# Altium schematic sheet 17.SchDoc
size 513 x 386 mm
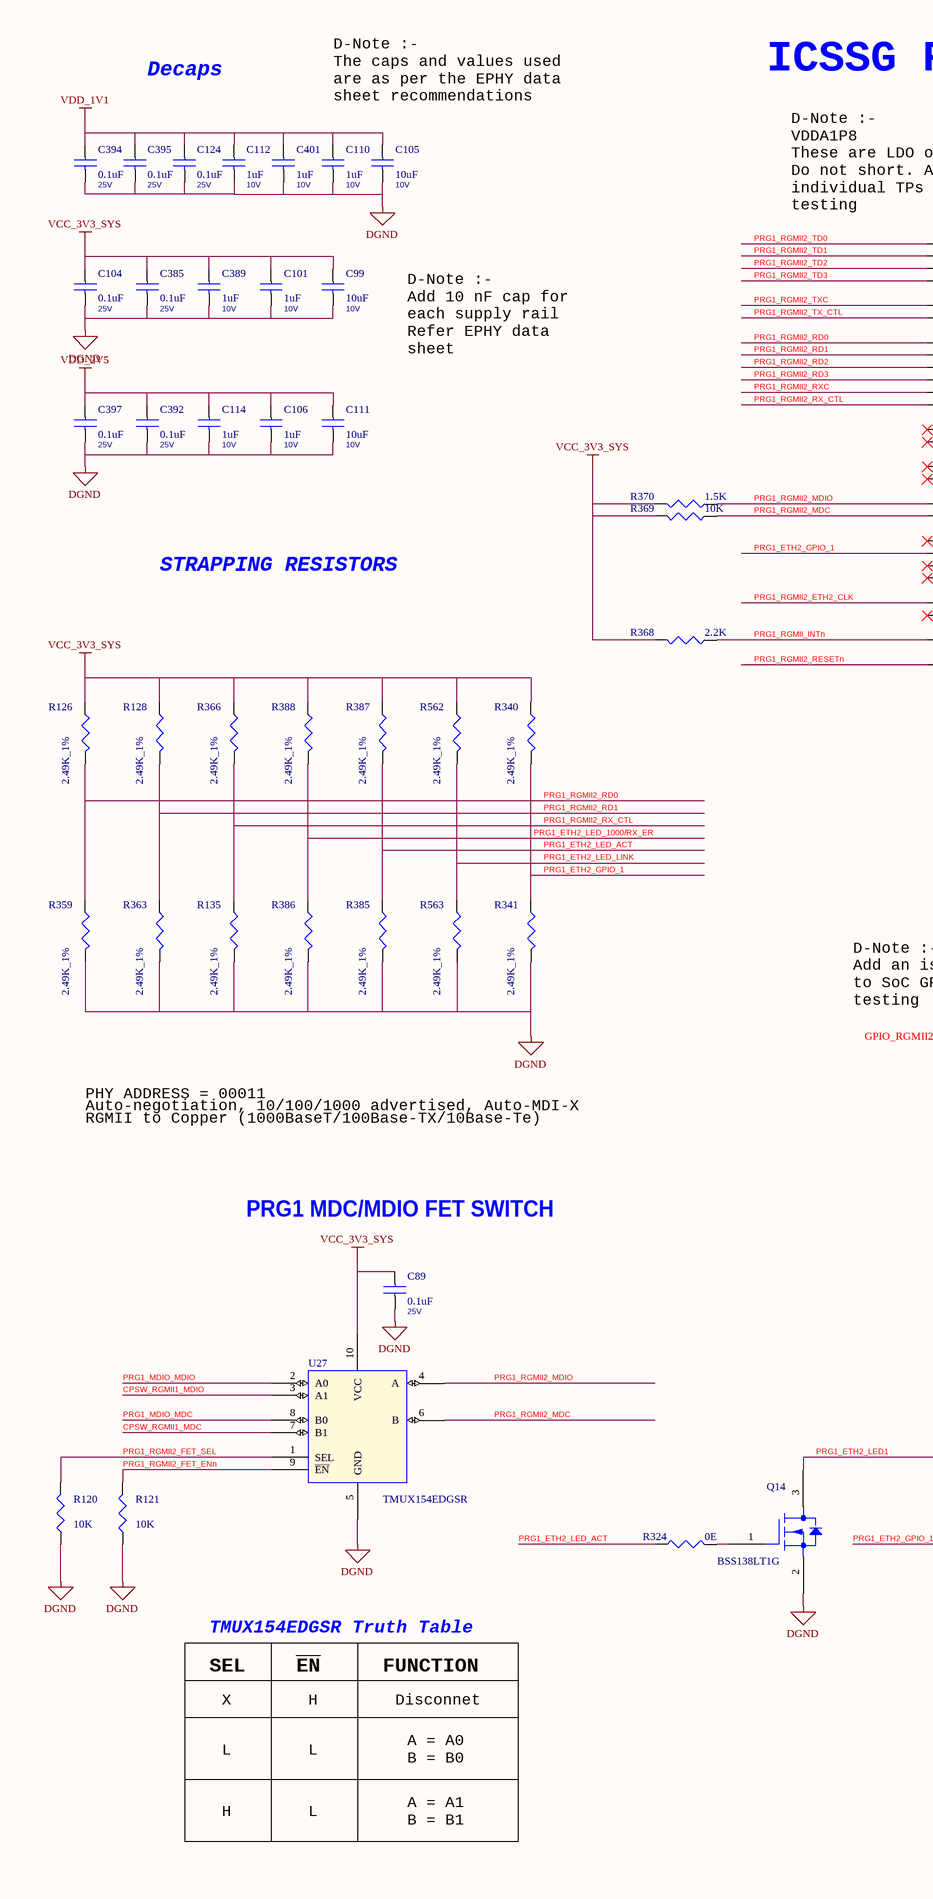
[diagram p0: 17.SchDoc, left]
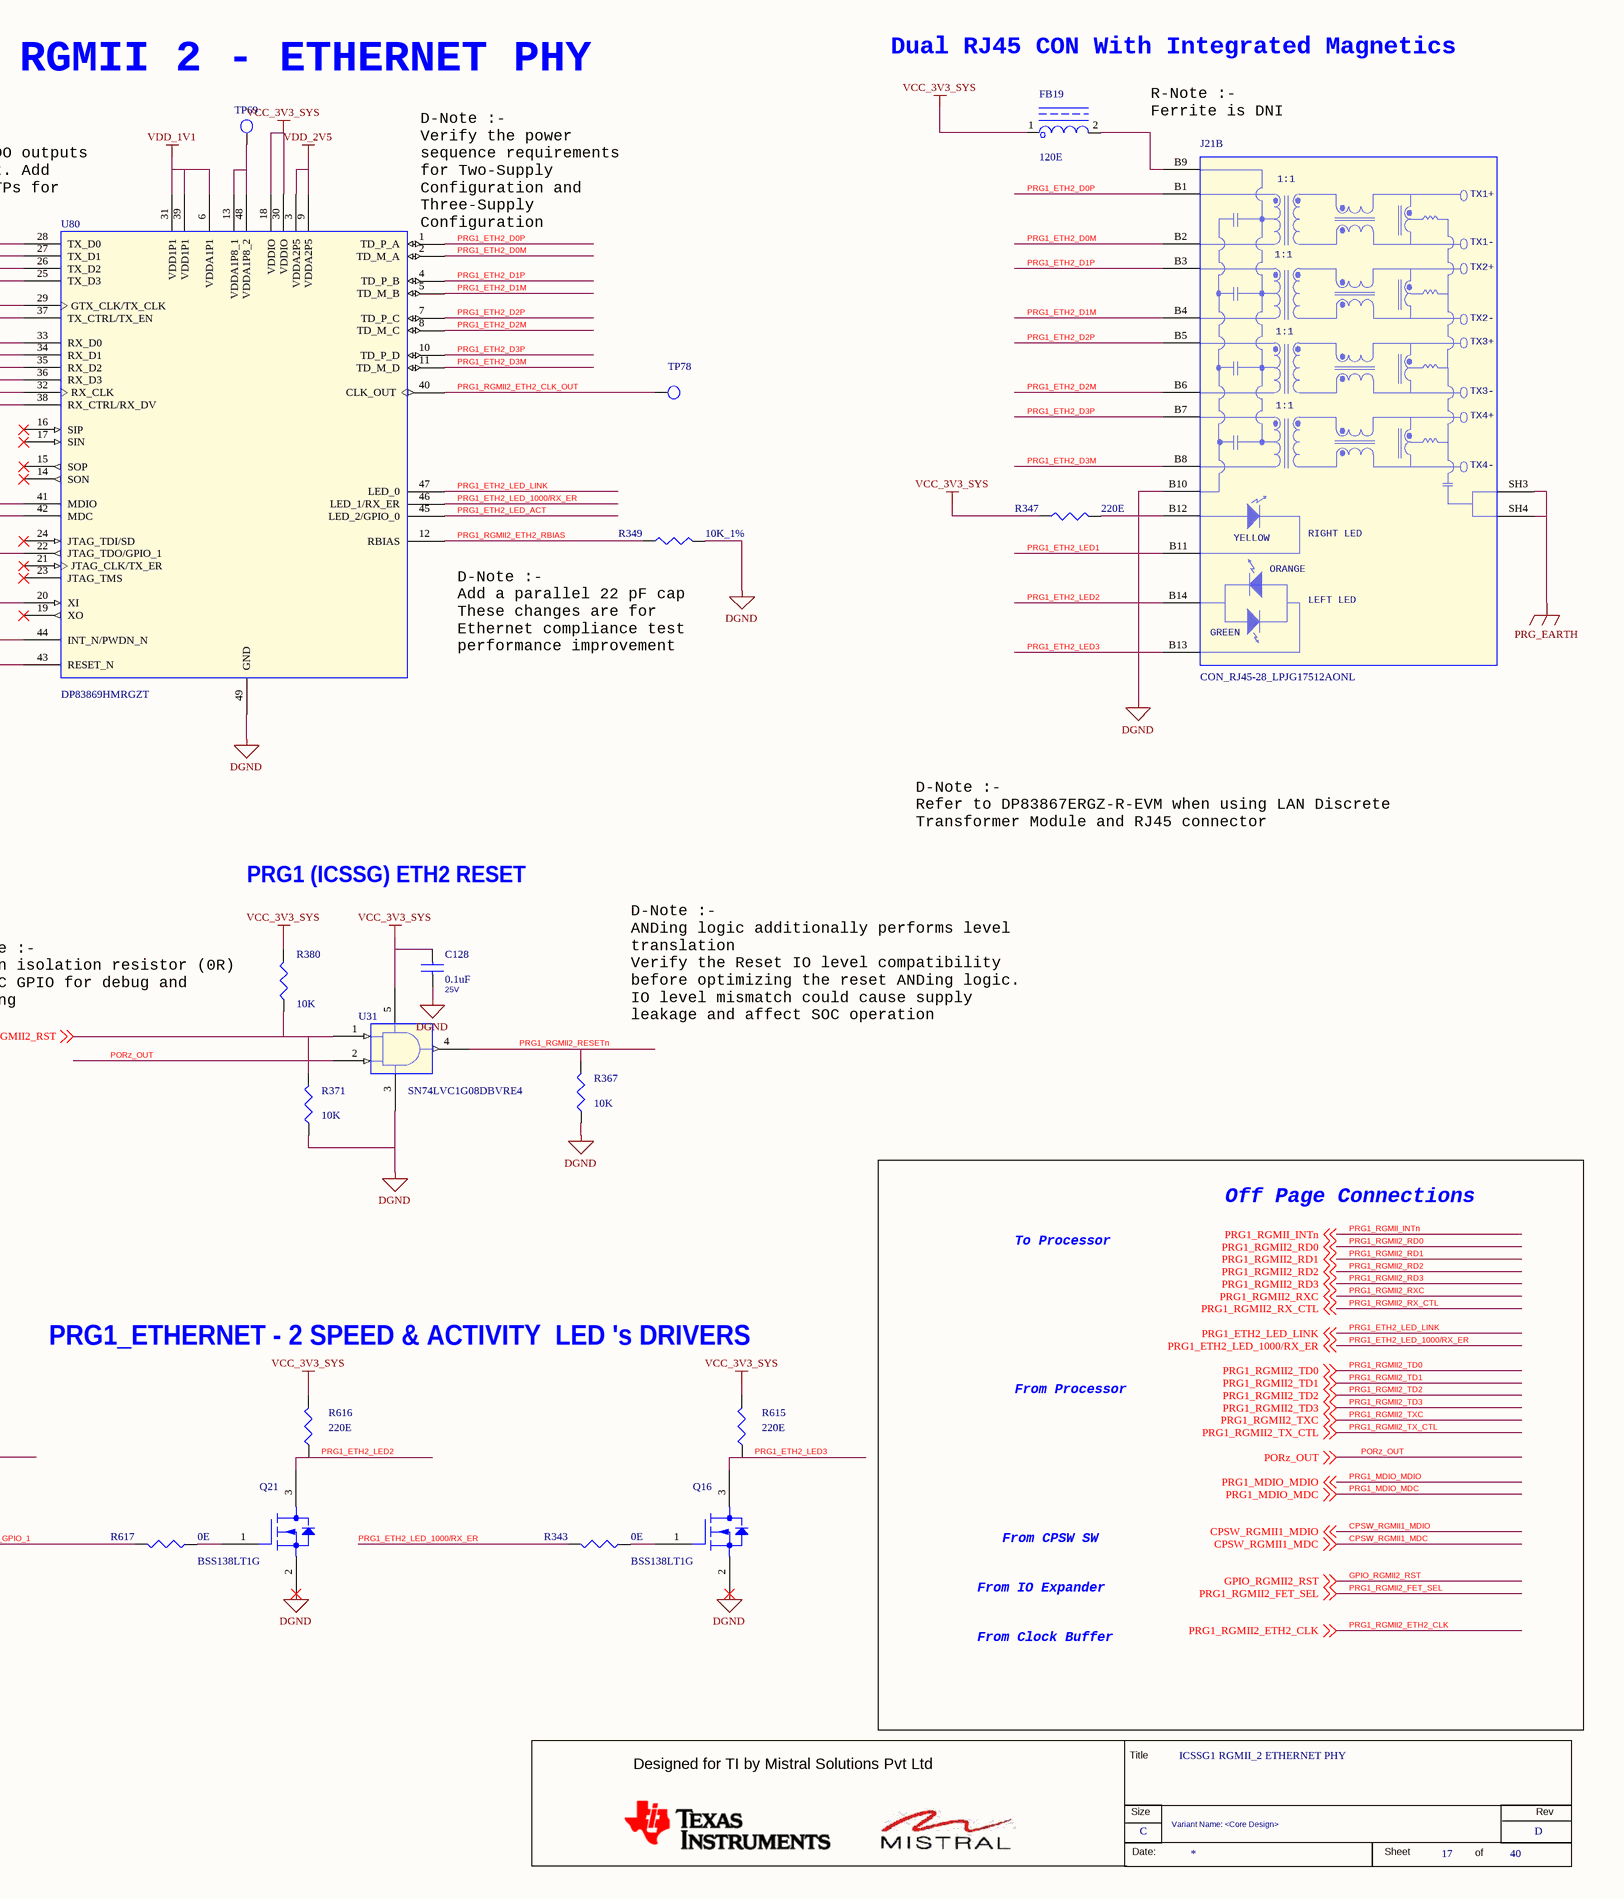
[diagram p1: 17.SchDoc, right]

## Parts
*  RevCode: D  Title: ICSSG1 RGMII_2 ETHERNET PHY  Page Size: C  Page Number: 17  Page Count: 40  Variant Name: <Core Design>  (hidden comment: MISTRAL_TITLEBLK_CSIZE)  (graphical)
C89  0.1uF  Voltage: 25V  [CAP0402_0-75]
C99  10uF  Voltage: 10V  [CAP0402_0-75]
C101  1uF  Voltage: 10V  [CAP0402_0-75]
C104  0.1uF  Voltage: 25V  [CAP0402_0-75]
C105  10uF  Voltage: 10V  [CAP0402_0-75]
C106  1uF  Voltage: 10V  [CAP0402_0-75]
C110  1uF  Voltage: 10V  [CAP0402_0-75]
C111  10uF  Voltage: 10V  [CAP0402_0-75]
C112  1uF  Voltage: 10V  [CAP0402_0-75]
C114  1uF  Voltage: 10V  [CAP0402_0-75]
C124  0.1uF  Voltage: 25V  [CAP0402_0-75]
C128  0.1uF  Voltage: 25V  [CAP0402_0-75]
C385  0.1uF  Voltage: 25V  [CAP0402_0-75]
C389  1uF  Voltage: 10V  [CAP0402_0-75]
C392  0.1uF  Voltage: 25V  [CAP0402_0-75]
C394  0.1uF  Voltage: 25V  [CAP0402_0-75]
C395  0.1uF  Voltage: 25V  [CAP0402_0-75]
C397  0.1uF  Voltage: 25V  [CAP0402_0-75]
C401  1uF  Voltage: 10V  [CAP0402_0-75]
FB19  120E  [IND0603_1]
J21  CON_RJ45-28_LPJG17512AONL  [CON_RJ45-28_LPJG17512_S_R_T_25-3]  (part B of 2)
Q14  BSS138LT1G  [SOT23-123_1-2]
Q16  BSS138LT1G  [SOT23-123_1-2]
Q21  BSS138LT1G  [SOT23-123_1-2]
R120  10K  [RES0402_0-5]
R121  10K  [RES0402_0-5]
R126  2.49K_1%  [RES0402_0-5]
R128  2.49K_1%  [RES0402_0-5]
R135  2.49K_1%  [RES0402_0-5]
R324  0E  [RES0402_0-5]
R340  2.49K_1%  [RES0402_0-5]
R341  2.49K_1%  [RES0402_0-5]
R343  0E  [RES0402_0-5]
R347  220E  [RES0402_0-5]
R349  10K_1%  [RES0402_0-5]
R359  2.49K_1%  [RES0402_0-5]
R363  2.49K_1%  [RES0402_0-5]
R366  2.49K_1%  [RES0402_0-5]
R367  10K  [RES0402_0-5]
R368  2.2K  [RES0402_0-5]
R369  10K  [RES0402_0-5]
R370  1.5K  [RES0402_0-5]
R371  10K  [RES0402_0-5]
R380  10K  [RES0402_0-5]
R385  2.49K_1%  [RES0402_0-5]
R386  2.49K_1%  [RES0402_0-5]
R387  2.49K_1%  [RES0402_0-5]
R388  2.49K_1%  [RES0402_0-5]
R562  2.49K_1%  [RES0402_0-5]
R563  2.49K_1%  [RES0402_0-5]
R615  220E  [RES0402_0-5]
R616  220E  [RES0402_0-5]
R617  0E  [RES0402_0-5]
TP69  TP20_SMD  [TP20_SMD]  (value not drawn)
TP78  TP20_SMD  [TP20_SMD]  (value not drawn)
U27  TMUX154EDGSR  [MSOP10_19-68_120X120_1-1]
U31  SN74LVC1G08DBVRE4  [SOT23-5]
U80  DP83869HMRGZT  [QFN48_19-68_280X280_1_EP4-2]

## Nets
DGND: C89.2 C99.2 C101.2 C104.2 C105.2 C106.2 C110.2 C111.2 C112.2 C114.2 C124.2 C128.2 C385.2 C389.2 C392.2 C394.2 C395.2 C397.2 C401.2 J21.B10(GND) Q14.2(S) Q16.2(S) Q21.2(S) R120.2 R121.2 R135.2 R341.2 R349.1 R359.2 R363.2 R367.2 R371.2 R385.2 R386.2 R563.2 U27.5(GND) U31.3(GND) U80.49(GND)
PRG_EARTH: J21.SH3 J21.SH4
VCC_3V3_SYS: C89.1 C99.1 C101.1 C104.1 C128.1 C385.1 C389.1 FB19.1 R126.1 R128.1 R340.1 R347.1 R366.1 R368.2 R369.1 R370.2 R380.2 R387.1 R388.1 R562.1 R615.2 R616.2 U27.10(VCC) U31.5(VCC) U80.18(VDDIO) U80.30(VDDIO)
VDD_1V1: C105.1 C110.1 C112.1 C124.1 C394.1 C395.1 C401.1 U80.6(VDDA1P1) U80.31(VDD1P1) U80.39(VDD1P1)
VDD_2V5: C106.1 C111.1 C114.1 C392.1 C397.1 U80.3(VDDA2P5) U80.9(VDDA2P5)
CPSW_RGMII1_MDC: U27.7(B1) ; off-sheet CPSW_RGMII1_MDC
CPSW_RGMII1_MDIO: U27.3(A1) ; off-sheet CPSW_RGMII1_MDIO
GPIO_RGMII2_RST: R371.1 R380.1 U31.1(A) ; off-sheet GPIO_RGMII2_RST
PORz_OUT: U31.2(B) ; off-sheet PORz_OUT
PRG1_ETH2_D0M: J21.B2(TD1-_2) U80.2(TD_M_A)
PRG1_ETH2_D0P: J21.B1(TD1+_2) U80.1(TD_P_A)
PRG1_ETH2_D1M: J21.B4(TD2-_2) U80.5(TD_M_B)
PRG1_ETH2_D1P: J21.B3(TD2+_2) U80.4(TD_P_B)
PRG1_ETH2_D2M: J21.B6(TD3-_2) U80.8(TD_M_C)
PRG1_ETH2_D2P: J21.B5(TD3+_2) U80.7(TD_P_C)
PRG1_ETH2_D3M: J21.B8(TD4-_2) U80.11(TD_M_D)
PRG1_ETH2_D3P: J21.B7(TD4+_2) U80.10(TD_P_D)
PRG1_ETH2_GPIO_1: R340.2 R341.1 R617.2 U80.22(JTAG_TDO/GPIO_1)
PRG1_ETH2_LED1: J21.B11 Q14.3(D)
PRG1_ETH2_LED2: J21.B14 Q21.3(D) R616.1
PRG1_ETH2_LED3: J21.B13 Q16.3(D) R615.1
PRG1_ETH2_LED_1000/RX_ER: R343.2 R386.1 R388.2 U80.46(LED_1/RX_ER) ; off-sheet PRG1_ETH2_LED_1000/RX_ER
PRG1_ETH2_LED_ACT: R324.1 R385.1 R387.2 U80.45(LED_2/GPIO_0)
PRG1_ETH2_LED_LINK: R562.2 R563.1 U80.47(LED_0) ; off-sheet PRG1_ETH2_LED_LINK
PRG1_MDIO_MDC: U27.8(B0) ; off-sheet PRG1_MDIO_MDC
PRG1_MDIO_MDIO: U27.2(A0) ; off-sheet PRG1_MDIO_MDIO
PRG1_RGMII2_ETH2_CLK: U80.20(XI) ; off-sheet PRG1_RGMII2_ETH2_CLK
PRG1_RGMII2_ETH2_CLK_OUT: TP78.1(TP) U80.40(CLK_OUT)
PRG1_RGMII2_ETH2_RBIAS: R349.2 U80.12(RBIAS)
PRG1_RGMII2_FET_ENn: R121.1 U27.9(~{EN})
PRG1_RGMII2_FET_SEL: R120.1 U27.1(SEL) ; off-sheet PRG1_RGMII2_FET_SEL
PRG1_RGMII2_MDC: R369.2 U27.6(B) U80.42(MDC)
PRG1_RGMII2_MDIO: R370.1 U27.4(A) U80.41(MDIO)
PRG1_RGMII2_RD0: R126.2 R359.1 U80.33(RX_D0) ; off-sheet PRG1_RGMII2_RD0
PRG1_RGMII2_RD1: R128.2 R363.1 U80.34(RX_D1) ; off-sheet PRG1_RGMII2_RD1
PRG1_RGMII2_RD2: U80.35(RX_D2) ; off-sheet PRG1_RGMII2_RD2
PRG1_RGMII2_RD3: U80.36(RX_D3) ; off-sheet PRG1_RGMII2_RD3
PRG1_RGMII2_RESETn: R367.1 U31.4(Y) U80.43(RESET_N)
PRG1_RGMII2_RX_CTL: R135.1 R366.2 U80.38(RX_CTRL/RX_DV) ; off-sheet PRG1_RGMII2_RX_CTL
PRG1_RGMII2_RXC: U80.32(RX_CLK) ; off-sheet PRG1_RGMII2_RXC
PRG1_RGMII2_TD0: U80.28(TX_D0) ; off-sheet PRG1_RGMII2_TD0
PRG1_RGMII2_TD1: U80.27(TX_D1) ; off-sheet PRG1_RGMII2_TD1
PRG1_RGMII2_TD2: U80.26(TX_D2) ; off-sheet PRG1_RGMII2_TD2
PRG1_RGMII2_TD3: U80.25(TX_D3) ; off-sheet PRG1_RGMII2_TD3
PRG1_RGMII2_TX_CTL: U80.37(TX_CTRL/TX_EN) ; off-sheet PRG1_RGMII2_TX_CTL
PRG1_RGMII2_TXC: U80.29(GTX_CLK/TX_CLK) ; off-sheet PRG1_RGMII2_TXC
PRG1_RGMII_INTn: R368.1 U80.44(INT_N/PWDN_N) ; off-sheet PRG1_RGMII_INTn
NetFB19_2: FB19.2 J21.B9(VCC)
NetJ21_B12: J21.B12 R347.2
NetQ14_1: Q14.1(G) R324.2
NetQ16_1: Q16.1(G) R343.1
NetQ21_1: Q21.1(G) R617.1
NetTP69_1: TP69.1(TP) U80.13(VDDA1P8_1) U80.48(VDDA1P8_2)

Not connected (* = marked no-connect by the designer): U80 14(SON)* 15(SOP)* 16(SIP)* 17(SIN)* 19(XO)* 21(JTAG_CLK/TX_ER)* 23(JTAG_TMS)* 24(JTAG_TDI/SD)*

## Notes on the sheet
- D-Note :-
  The caps and values used
  are as per the EPHY data
  sheet recommendations
- Decaps
- ICSSG RGMII 2 - ETHERNET PHY
- (near U80) D-Note :-
  VDDA1P8
  These are LDO outputs
  Do not short. Add
  individual TPs for
  testing
- (near U80) D-Note :-
  Verify the power
  sequence requirements
  for Two-Supply
  Configuration and
  Three-Supply
  Configuration
- Dual RJ45 CON With Integrated Magnetics
- R-Note :-
  Ferrite is DNI
- D-Note :-
  Add 10 nF cap for
  each supply rail
  Refer EPHY data
  sheet
- STRAPPING RESISTORS
- (near R349) D-Note :-
  Add a parallel 22 pF cap
  These changes are for
  Ethernet compliance test
  performance improvement
- D-Note :-
  Refer to DP83867ERGZ-R-EVM when using LAN Discrete
  Transformer Module and RJ45 connector
- PRG1 (ICSSG) ETH2 RESET
- D-Note :-
  ANDing logic additionally performs level
  translation
  Verify the Reset IO level compatibility
  before optimizing the reset ANDing logic.
  IO level mismatch could cause supply
  leakage and affect SOC operation
- (near R380) D-Note :-
  Add an isolation resistor (0R)
  to SoC GPIO for debug and
  testing
- PHY ADDRESS = 00011
- Auto-negotiation, 10/100/1000 advertised, Auto-MDI-X
- RGMII to Copper (1000BaseT/100Base-TX/10Base-Te)
- PRG1 MDC/MDIO FET SWITCH
- Off Page Connections
- To Processor
- PRG1_ETHERNET - 2 SPEED & ACTIVITY  LED 's DRIVERS
- From Processor
- From IO Expander
- From CPSW SW
- TMUX154EDGSR Truth Table
- From Clock Buffer
- SEL
- X
- EN
- H
- FUNCTION
- Disconnet
- L
- A = A0
  B = B0
- A = A1
  B = B1
- (in symbol CON_RJ45-28_LPJG17512AONL, part B) 1:1; TX1+; TX1-; TX2+; TX2-; TX3+; TX3-; TX4+; TX4-; RIGHT LED; YELLOW; ORANGE; LEFT LED; GREEN
- (in symbol MISTRAL_TITLEBLK_CSIZE) Title; Designed for TI by Mistral Solutions Pvt Ltd; Size; Rev; Date:; Sheet; of

## Library data of the parts
* = MISTRAL_TITLEBLK_CSIZE: Issue: 1.0; Page Create Date: March  8, 1995; Page Modify Date: *
C89 C104 C124 C128 C385 C392 C394 C395 C397 = CAP_Dup3: CAP CERAMIC 0.1uF 25V 20% X5R 0402; Alt_Mfr_part_number: CC0402KRX5R8BB104; Mistral Part No: 120020080003-R; Mfr_name: WURTH ELECTRONICS; Mfr_part_number: 885012105018; Part_type: CAPACITORS\CERAMIC; Alt_Mfr_name: YAGEO AMERICA; Project: AM64x_EVM_BRD; Wattage: NA; Customs_HS_Code: 85322990; Custom_Duty: 15%; Tolerance: 20%; Package: 0402; Distributor_name: DIGIKEY; Distributor_part_number: 732-7495-1-ND; Height: 0.55MM; Weight: 0.65mg; Temperature: -55癈+85癈; Datasheet: Y:\MIS_DATABASE\DATASHEETS\CAPACITORS\885012105018.PDF; Crtd /date: ALVY/170820; Chkd/date: MANIRAJA/170820; MECHANICAL 3D STEP FILE: CAP0402_0-75; Library Ref: CAP; Footprint Ref: CAP0402_0-75; Library Path: Y:\MIS_DATABASE\Library\ALTIUM_TOOL\SCHEMATICS_PARTS\MS_DISCRETE_Library.schlib; Footprint Path: Y:\MIS_DATABASE\Library\ALTIUM_TOOL\PCB_FOOTPRINTS\Altium_Footprint_Lib.PcbLib; PCB Footprint: CAP0402_0-75
C99 = CAP_Dup3: CAP CERAMIC 10uF 10V 20% X5R 0402; Part_type: CAPACITORS\CERAMIC; Mfr_part_number: GRM155R61A106ME11D; Mfr_name: MURATA; Mistral Part No: 120013110019-R; Wattage: NA; Custom_Duty: 15%; Customs_HS_Code: 85322990; Project: QCS610_NANOSOM; Library Ref: CAP; MECHANICAL 3D STEP FILE: CAP0402_0-75; Temperature: -55癈+85癈; Weight: 3.1mg; Chkd/date: MANIRAJA/300520; Crtd /date: ALVY/260520; Datasheet: Y:\MIS_DATABASE\DATASHEETS\CAPACITORS\MURATA-GXX-SER_NOV17.PDF; Height: 0.55MM; Distributor_part_number: 490-GRM155R61A106ME11DTR-ND; Distributor_name: DIGIKEY; Package: 0402; Tolerance: 20%; Footprint Ref: CAP0402_0-75; Library Path: Y:\MIS_DATABASE\Library\ALTIUM_TOOL\SCHEMATICS_PARTS\MS_DISCRETE_Library.schlib; Footprint Path: Y:\MIS_DATABASE\Library\ALTIUM_TOOL\PCB_FOOTPRINTS\Altium_Footprint_Lib.PcbLib; PCB Footprint: CAP0402_0-75
C101 C106 C110 C112 C114 C389 = CAP_Dup3: CAP CERAMIC 1uF 10V 20% X5R 0402; Part_type: CAPACITORS\CERAMIC; Mfr_part_number: 885012105012; Mfr_name: WURTH ELECTRONICS; Mistral Part No: 120020080009-R; Custom_Duty: 15%; Customs_HS_Code: 85322990; Wattage: NA; Project: AM64x_EVM_BRD; Footprint Ref: CAP0402_0-75; Library Ref: CAP; Chkd/date: MANIRAJA/210820; Crtd /date: ALVY/190820; Datasheet: Y:\MIS_DATABASE\DATASHEETS\CAPACITORS\885012105012.PDF; Temperature: -55癈+85癈; Weight: 0.65mg; Height: 0.55MM; Distributor_part_number: 732-7489-1-ND; Distributor_name: DIGIKEY; Package: 0402; Tolerance: 20%; MECHANICAL 3D STEP FILE: CAP0402_0-75; Library Path: Y:\MIS_DATABASE\Library\ALTIUM_TOOL\SCHEMATICS_PARTS\MS_DISCRETE_Library.schlib; Footprint Path: Y:\MIS_DATABASE\Library\ALTIUM_TOOL\PCB_FOOTPRINTS\Altium_Footprint_Lib.PcbLib; PCB Footprint: CAP0402_0-75
C105 = CAP_Dup3: CAP CERAMIC 10uF 10V 20% X5R 0402; Mistral Part No: 120013110019-R; Mfr_name: MURATA; Mfr_part_number: GRM155R61A106ME11D; Part_type: CAPACITORS\CERAMIC; Wattage: NA; Project: QCS610_NANOSOM; Customs_HS_Code: 85322990; Custom_Duty: 15%; Library Ref: CAP; MECHANICAL 3D STEP FILE: CAP0402_0-75; Temperature: -55癈+85癈; Weight: 3.1mg; Tolerance: 20%; Package: 0402; Distributor_name: DIGIKEY; Distributor_part_number: 490-GRM155R61A106ME11DTR-ND; Height: 0.55MM; Datasheet: Y:\MIS_DATABASE\DATASHEETS\CAPACITORS\MURATA-GXX-SER_NOV17.PDF; Crtd /date: ALVY/260520; Chkd/date: MANIRAJA/300520; Footprint Ref: CAP0402_0-75; Library Path: Y:\MIS_DATABASE\Library\ALTIUM_TOOL\SCHEMATICS_PARTS\MS_DISCRETE_Library.schlib; Footprint Path: Y:\MIS_DATABASE\Library\ALTIUM_TOOL\PCB_FOOTPRINTS\Altium_Footprint_Lib.PcbLib; PCB Footprint: CAP0402_0-75
C111 = CAP_Dup3: CAP CERAMIC 10uF 10V 20% X5R 0402; Part_type: CAPACITORS\CERAMIC; Mfr_part_number: GRM155R61A106ME11D; Mfr_name: MURATA; Mistral Part No: 120013110019-R; Custom_Duty: 15%; Customs_HS_Code: 85322990; Project: QCS610_NANOSOM; Wattage: NA; Chkd/date: MANIRAJA/300520; Crtd /date: ALVY/260520; Datasheet: Y:\MIS_DATABASE\DATASHEETS\CAPACITORS\MURATA-GXX-SER_NOV17.PDF; Height: 0.55MM; Distributor_part_number: 490-GRM155R61A106ME11DTR-ND; Distributor_name: DIGIKEY; Package: 0402; Tolerance: 20%; Weight: 3.1mg; Temperature: -55癈+85癈; MECHANICAL 3D STEP FILE: CAP0402_0-75; Library Ref: CAP; Footprint Ref: CAP0402_0-75; Library Path: Y:\MIS_DATABASE\Library\ALTIUM_TOOL\SCHEMATICS_PARTS\MS_DISCRETE_Library.schlib; Footprint Path: Y:\MIS_DATABASE\Library\ALTIUM_TOOL\PCB_FOOTPRINTS\Altium_Footprint_Lib.PcbLib; PCB Footprint: CAP0402_0-75
C401 = CAP_Dup3: CAP CERAMIC 1uF 10V 20% X5R 0402; Mistral Part No: 120020080009-R; Mfr_name: WURTH ELECTRONICS; Mfr_part_number: 885012105012; Part_type: CAPACITORS\CERAMIC; Project: AM64x_EVM_BRD; Wattage: NA; Customs_HS_Code: 85322990; Custom_Duty: 15%; Footprint Ref: CAP0402_0-75; Library Ref: CAP; Tolerance: 20%; Package: 0402; Distributor_name: DIGIKEY; Distributor_part_number: 732-7489-1-ND; Height: 0.55MM; Weight: 0.65mg; Temperature: -55癈+85癈; Datasheet: Y:\MIS_DATABASE\DATASHEETS\CAPACITORS\885012105012.PDF; Crtd /date: ALVY/190820; Chkd/date: MANIRAJA/210820; MECHANICAL 3D STEP FILE: CAP0402_0-75; Library Path: Y:\MIS_DATABASE\Library\ALTIUM_TOOL\SCHEMATICS_PARTS\MS_DISCRETE_Library.schlib; Footprint Path: Y:\MIS_DATABASE\Library\ALTIUM_TOOL\PCB_FOOTPRINTS\Altium_Footprint_Lib.PcbLib; PCB Footprint: CAP0402_0-75
FB19 = INDUCTOR_FERRITE: IND FERRITE BEAD CHIP 120E 2A 0603; Mistral Part No: 130020080015-R; Mfr_name: WURTH ELECTRONICS; Mfr_part_number: 782631141; Project: AM64x_EVM_BRD; Tolerance: 25%; Voltage: NA; Customs_HS_Code: 85437099; Custom_Duty: 24%; Footprint Ref: IND0603_1; Part_type: INDUCTOR; Wattage: NA; Package: 0603; Distributor_name: DIGIKEY; Distributor_part_number: 732-782631141CT-ND; Library Ref: INDUCTOR_FERRITE; Height: 1.00MM; Weight: NA; Temperature: -55癈+125癈; Datasheet: Y:\MIS_DATABASE\DATASHEETS\DISCRETES\INDUCTORS\782631141.PDF; Crtd /date: ALVY/180820; Chkd/date: MANIRAJA/180820; MECHANICAL 3D STEP FILE: IND0603_1; Library Path: Y:\MIS_DATABASE\Library\ALTIUM_TOOL\SCHEMATICS_PARTS\MS_FILTER_Library.schlib; Footprint Path: Y:\MIS_DATABASE\Library\ALTIUM_TOOL\PCB_FOOTPRINTS\Altium_Footprint_Lib.PcbLib; PCB Footprint: IND0603_1
J21 = CON_RJ45-28_LPJG17512AONL: CON JACK RJ45 28POS REGISTERED FEMALE RA TH; Mistral Part No: 150017080001-R; Mfr_name: LINK-PP; Part_type: CONNECTOR\JACK; Project: TI_SVB_DUT; Tolerance: NA; Customs_HS_Code: 85369090; Custom_Duty: 24%; PCB Footprint: CON_RJ45-28_LPJG17512_S_R_T_25-3; Library Ref: CON_RJ45-28_LPJG17512AONL; Mfr_part_number: LPJG17512AONL; Voltage: NA; Wattage: NA; Package: THRU-HOLE; Distributor_name: NA; Distributor_part_number: NA; Height: 25.30MM; Weight: NA; Temperature: 0癈+70癈; Datasheet: Y:\MIS_DATABASE\DATASHEETS\CONNECTORS\LPJG17512AONL.PDF; Crtd /date: MANIRAJA/010817; Chkd/date: MANIRAJA/010817; MECHANICAL 3D STEP FILE: CON_RJ45-28_LPJG17512_S_R_T_25-3
Q14 Q16 Q21 = MOSFET_BSS138LT1G: IC MOSFET N-CHANNEL 50V 200mA SOT23-3; Mistral Part No: 142016040001-R; Mfr_name: ON SEMICONDUCTOR; Part_type: ICS\POWER\MOSFET; Project: LRDE_ABCM; Tolerance: NA; Customs_HS_Code: 85423100; Custom_Duty: 15%; PCB Footprint: SOT23-123_1-2; Footprint Path: Y:\MIS_DATABASE\Library\ALTIUM_TOOL\PCB_FOOTPRINTS\Altium_Footprint_Lib.PcbLib; Library Path: Y:\MIS_DATABASE\Library\ALTIUM_TOOL\SCHEMATICS_PARTS\MS_MOSFET_Library.schlib; MECHANICAL 3D STEP FILE: SOT23-123_1-2; Footprint Ref: SOT23-123_1-2; Mfr_part_number: BSS138LT1G; Voltage: NA; Wattage: NA; Package: SOT23-3; Distributor_name: DIGIKEY; Distributor_part_number: BSS138LT1GOSCT-ND; Height: 1.11MM; Weight: 8mg; Temperature: -55癈+150癈; Datasheet: Y:\MIS_DATABASE\DATASHEETS\DISCRETES\TRANSISTORS_FETS\BSS138LT1G.PDF; Crtd /date: JEBRAN/060416; Chkd/date: MANIRAJA/250219; Library Ref: MOSFET_BSS138W
R120 R367 R380 = RESISTOR_Dup6: RES 10K 1/16W 5% 0402; Mistral Part No: 110011060021-R; Mfr_name: YAGEO AMERICA; Mfr_part_number: RC0402JR-0710KL; Part_type: RESISTORS\FIXED; Project: HSE; Voltage: NA; Customs_HS_Code: 85332119; Custom_Duty: 15%; PCB Footprint: RES0402_0-5; Tolerance: 5%; Wattage: 1/16W; Package: 0402; Distributor_name: DIGIKEY; Distributor_part_number: 311-10KJRCT-ND; Height: 0.40MM; Weight: 0.65mg; Temperature: -55癈+155癈; Datasheet: Y:\MIS_DATABASE\DATASHEETS\RESISTORS\RCXXXXL-SER_MAR18.PDF; Crtd /date: MAZHAR/230805; Chkd/date: VASANTHA/061216; MECHANICAL 3D STEP FILE: RES0402_0-5; Library Ref: RESISTOR; Footprint Ref: RES0402_0-5; Library Path: Y:\MIS_DATABASE\Library\ALTIUM_TOOL\SCHEMATICS_PARTS\MS_DISCRETE_Library.schlib; Footprint Path: Y:\MIS_DATABASE\Library\ALTIUM_TOOL\PCB_FOOTPRINTS\Altium_Footprint_Lib.PcbLib
R121 R369 R371 = RESISTOR_Dup6: RES 10K 1/16W 5% 0402; Part_type: RESISTORS\FIXED; Mfr_part_number: RC0402JR-0710KL; Mfr_name: YAGEO AMERICA; Mistral Part No: 110011060021-R; Custom_Duty: 15%; Customs_HS_Code: 85332119; Voltage: NA; Project: HSE; PCB Footprint: RES0402_0-5; Footprint Path: Y:\MIS_DATABASE\Library\ALTIUM_TOOL\PCB_FOOTPRINTS\Altium_Footprint_Lib.PcbLib; Library Path: Y:\MIS_DATABASE\Library\ALTIUM_TOOL\SCHEMATICS_PARTS\MS_DISCRETE_Library.schlib; Footprint Ref: RES0402_0-5; Library Ref: RESISTOR; MECHANICAL 3D STEP FILE: RES0402_0-5; Chkd/date: VASANTHA/061216; Crtd /date: MAZHAR/230805; Datasheet: Y:\MIS_DATABASE\DATASHEETS\RESISTORS\RCXXXXL-SER_MAR18.PDF; Temperature: -55癈+155癈; Weight: 0.65mg; Height: 0.40MM; Distributor_part_number: 311-10KJRCT-ND; Distributor_name: DIGIKEY; Package: 0402; Wattage: 1/16W; Tolerance: 5%
R126 R128 R341 R359 R366 R386 R388 R563 = RESISTOR_Dup6: RES 2.49K 1/16W 1% 0402; Part_type: RESISTORS\FIXED; Mfr_part_number: RC0402FR-072K49L; Mfr_name: YAGEO AMERICA; Mistral Part No: 110016050020-R; Custom_Duty: 15%; Customs_HS_Code: 85332119; Voltage: NA; Project: TMDXCSKCC; PCB Footprint: RES0402_0-5; Library Ref: RESISTOR; Chkd/date: VASANTHA/270516; Crtd /date: VASANTHA/270516; Datasheet: Y:\MIS_DATABASE\DATASHEETS\RESISTORS\RCXXXXL-SER_MAR18.PDF; Temperature: -55癈+155癈; Weight: 0.65mg; Height: 0.40MM; Distributor_part_number: 311-2.49KLRCT-ND; Distributor_name: DIGIKEY; Package: 0402; Wattage: 1/16W; Tolerance: 1%; Footprint Ref: RES0402_0-5; MECHANICAL 3D STEP FILE: RES0402_0-5; Library Path: Y:\MIS_DATABASE\Library\ALTIUM_TOOL\SCHEMATICS_PARTS\MS_DISCRETE_Library.schlib; Footprint Path: Y:\MIS_DATABASE\Library\ALTIUM_TOOL\PCB_FOOTPRINTS\Altium_Footprint_Lib.PcbLib
R135 R340 R363 R385 R387 R562 = RESISTOR_Dup6: RES 2.49K 1/16W 1% 0402; Mistral Part No: 110016050020-R; Mfr_name: YAGEO AMERICA; Mfr_part_number: RC0402FR-072K49L; Part_type: RESISTORS\FIXED; Project: TMDXCSKCC; Voltage: NA; Customs_HS_Code: 85332119; Custom_Duty: 15%; PCB Footprint: RES0402_0-5; Footprint Path: Y:\MIS_DATABASE\Library\ALTIUM_TOOL\PCB_FOOTPRINTS\Altium_Footprint_Lib.PcbLib; Library Path: Y:\MIS_DATABASE\Library\ALTIUM_TOOL\SCHEMATICS_PARTS\MS_DISCRETE_Library.schlib; MECHANICAL 3D STEP FILE: RES0402_0-5; Footprint Ref: RES0402_0-5; Tolerance: 1%; Wattage: 1/16W; Package: 0402; Distributor_name: DIGIKEY; Distributor_part_number: 311-2.49KLRCT-ND; Height: 0.40MM; Weight: 0.65mg; Temperature: -55癈+155癈; Datasheet: Y:\MIS_DATABASE\DATASHEETS\RESISTORS\RCXXXXL-SER_MAR18.PDF; Crtd /date: VASANTHA/270516; Chkd/date: VASANTHA/270516; Library Ref: RESISTOR
R324 R343 R617 = RESISTOR_Dup5: RES 0E 1/16W JUMPER 0402; Part_type: RESISTORS\FIXED; Mfr_part_number: CRCW04020000Z0ED; Mfr_name: VISHAY; Mistral Part No: 110010080019-R; Custom_Duty: 15%; Customs_HS_Code: 85332119; Voltage: NA; Project: PB_BUGBASE; PCB Footprint: RES0402_0-5; Footprint Path: Y:\MIS_DATABASE\Library\ALTIUM_TOOL\PCB_FOOTPRINTS\Altium_Footprint_Lib.PcbLib; Library Path: Y:\MIS_DATABASE\Library\ALTIUM_TOOL\SCHEMATICS_PARTS\MS_DISCRETE_Library.schlib; Footprint Ref: RES0402_0-5; Library Ref: RESISTOR; MECHANICAL 3D STEP FILE: RES0402_0-5; Chkd/date: VASANTHA/201216; Crtd /date: MUDDU/190810; Datasheet: Y:\MIS_DATABASE\DATASHEETS\RESISTORS\CRCW0603.PDF; Temperature: -55癈+155癈; Weight: 0.65mg; Height: 0.40MM; Distributor_part_number: 541-0.0JCT-ND; Distributor_name: DIGIKEY; Package: 0402; Wattage: 1/16W; Tolerance: NA
R347 = RESISTOR_Dup6: RES 220E 1/10W 5% 0402; Mistral Part No: 110009030506-R; Mfr_name: PANASONIC-ECG; Mfr_part_number: ERJ-2GEJ221X; Part_type: RESISTORS\FIXED; Project: RED EYE; Customs_HS_Code: 85332119; Custom_Duty: 15%; Voltage: NA; PCB Footprint: RES0402_0-5; Footprint Ref: RES0402_0-5; Tolerance: 5%; Wattage: 1/10W; Package: 0402; Distributor_name: DIGIKEY; Distributor_part_number: P220JCT-ND; Height: 0.40MM; Datasheet: Y:\MIS_DATABASE\DATASHEETS\RESISTORS\PAN-ERJSER_NOV17.PDF; Crtd /date: GEETHA/260406; Chkd/date: VASANTHA/291216; Library Ref: RESISTOR; Weight: 0.8mg; Temperature: -55癈+155癈; MECHANICAL 3D STEP FILE: RES0402_0-5; Library Path: Y:\MIS_DATABASE\Library\ALTIUM_TOOL\SCHEMATICS_PARTS\MS_DISCRETE_Library.schlib; Footprint Path: Y:\MIS_DATABASE\Library\ALTIUM_TOOL\PCB_FOOTPRINTS\Altium_Footprint_Lib.PcbLib
R349 = RESISTOR_Dup6: RES 10K 1/10W 1% AUTO 0402; Part_type: RESISTORS\FIXED; Mfr_part_number: MCS0402MC1002FE000; Mfr_name: VISHAY; Mistral Part No: 110020100039-R; Custom_Duty: 15%; Customs_HS_Code: 85332119; Voltage: NA; Project: MCX_80MHz_ADC_DRIVER; PCB Footprint: RES0402_0-5; Footprint Path: Y:\MIS_DATABASE\Library\ALTIUM_TOOL\PCB_FOOTPRINTS\Altium_Footprint_Lib.PcbLib; Library Path: Y:\MIS_DATABASE\Library\ALTIUM_TOOL\SCHEMATICS_PARTS\MS_DISCRETE_Library.schlib; Footprint Ref: RES0402_0-5; Library Ref: RESISTOR; MECHANICAL 3D STEP FILE: RES0402_0-5; Chkd/date: MANIRAJA/191020; Crtd /date: ALVY/191020; Datasheet: Y:\MIS_DATABASE\DATASHEETS\RESISTORS\MCTXXXXM-SER.PDF; Temperature: -55癈+175癈; Weight: 0.65mg; Height: 0.37MM; Distributor_part_number: MCS0402-10.0K-MFCT-ND; Distributor_name: DIGIKEY; Package: 0402; Wattage: 1/10W; Tolerance: 1%
R368 = RESISTOR_Dup6: RES 2.2K 1/16W 5% 0402; Part_type: RESISTORS\FIXED; Mfr_part_number: RC0402JR-072K2L; Mfr_name: YAGEO AMERICA; Mistral Part No: 110010120018-R; Custom_Duty: 15%; Customs_HS_Code: 85332119; Voltage: NA; Project: TE4; PCB Footprint: RES0402_0-5; Library Path: Y:\MIS_DATABASE\Library\ALTIUM_TOOL\SCHEMATICS_PARTS\MS_DISCRETE_Library.schlib; Footprint Ref: RES0402_0-5; Footprint Path: Y:\MIS_DATABASE\Library\ALTIUM_TOOL\PCB_FOOTPRINTS\Altium_Footprint_Lib.PcbLib; MECHANICAL 3D STEP FILE: RES0402_0-5; Chkd/date: VASANTHA/061216; Crtd /date: BAVISH/021210; Datasheet: Y:\MIS_DATABASE\DATASHEETS\RESISTORS\RCXXXXL-SER_MAR18.PDF; Temperature: -55癈+155癈; Weight: 0.65mg; Height: 0.40MM; Distributor_part_number: 311-2.2KJRCT-ND; Distributor_name: DIGIKEY; Package: 0402; Wattage: 1/16W; Tolerance: 5%; Library Ref: RESISTOR
R370 = RESISTOR_Dup6: RES 1.5K 1/16W 5% 0402; Mistral Part No: 110010120012-R; Mfr_name: YAGEO AMERICA; Mfr_part_number: RC0402JR-071K5L; Part_type: RESISTORS\FIXED; Project: TE4; Voltage: NA; Customs_HS_Code: 85332119; Custom_Duty: 15%; PCB Footprint: RES0402_0-5; Library Path: Y:\MIS_DATABASE\Library\ALTIUM_TOOL\SCHEMATICS_PARTS\MS_DISCRETE_Library.schlib; Footprint Ref: RES0402_0-5; Tolerance: 5%; Wattage: 1/16W; Package: 0402; Distributor_name: DIGIKEY; Distributor_part_number: 311-1.5KJRCT-ND; Height: 0.40MM; Weight: 0.65mg; Temperature: -55癈+155癈; Datasheet: Y:\MIS_DATABASE\DATASHEETS\RESISTORS\RCXXXXL-SER_MAR18.PDF; Crtd /date: BAVISH/021210; Chkd/date: MANIRAJA/310718; MECHANICAL 3D STEP FILE: RES0402_0-5; Footprint Path: Y:\MIS_DATABASE\Library\ALTIUM_TOOL\PCB_FOOTPRINTS\Altium_Footprint_Lib.PcbLib; Library Ref: RESISTOR
R615 R616 = RESISTOR_Dup6: RES 220E 1/10W 5% 0402; Mistral Part No: 110009030506-R; Mfr_name: PANASONIC-ECG; Mfr_part_number: ERJ-2GEJ221X; Part_type: RESISTORS\FIXED; Voltage: NA; Project: RED EYE; Customs_HS_Code: 85332119; Custom_Duty: 15%; PCB Footprint: RES0402_0-5; Footprint Ref: RES0402_0-5; Footprint Path: Y:\MIS_DATABASE\Library\ALTIUM_TOOL\PCB_FOOTPRINTS\Altium_Footprint_Lib.PcbLib; Library Path: Y:\MIS_DATABASE\Library\ALTIUM_TOOL\SCHEMATICS_PARTS\MS_DISCRETE_Library.schlib; MECHANICAL 3D STEP FILE: RES0402_0-5; Temperature: -55癈+155癈; Weight: 0.8mg; Library Ref: RESISTOR; Tolerance: 5%; Wattage: 1/10W; Package: 0402; Distributor_name: DIGIKEY; Distributor_part_number: P220JCT-ND; Height: 0.40MM; Datasheet: Y:\MIS_DATABASE\DATASHEETS\RESISTORS\PAN-ERJSER_NOV17.PDF; Crtd /date: GEETHA/260406; Chkd/date: VASANTHA/291216
TP69 TP78 = TESTPOINT: TESTPOINT CIR 20 SMD; Mfr_name: LOCAL; Custom_Duty: NA; Project: BT MODULE_CSRBC04; PCB Footprint: TP20_SMD; Customs_HS_Code: NA; RoHS: NA; Footprint Ref: TP20_SMD; Library Ref: TESTPOINT; Mistral Part No: NA; Mfr_part_number: TP20_SMD; Part_type: TESTPOINT; Package: SMD; Distributor_name: NA; Distributor_part_number: NA; Height: NA; Crtd /date: MAZHAR/171006; Chkd/date: SHREESHAIL/171006; Tolerance: NA; Voltage: NA; Wattage: NA; Weight: NA; Temperature: NA; Datasheet: NA; MECHANICAL 3D STEP FILE: NA; Library Path: Y:\MIS_DATABASE\Library\ALTIUM_TOOL\SCHEMATICS_PARTS\MS_DISCRETE_Library.schlib; Footprint Path: Y:\MIS_DATABASE\Library\ALTIUM_TOOL\PCB_FOOTPRINTS\Altium_Footprint_Lib.PcbLib
U27 = TMUX154EDGSR_VSSOP10: IC ESD PROTECTED 2-CH 2:1 SWITCH WITH POWERED-OFF PROTECTION VSSOP10; Mistral Part No: 140118090001-R; Mfr_name: TEXAS INSTRUMENTS; Part_type: ICS\ANALOG\SWITCH; Project: DLRL_DFP_ATRUC CARD; Tolerance: NA; Customs_HS_Code: 85423100; Custom_Duty: 15%; PCB Footprint: MSOP10_19-68_120X120_1-1; Footprint Ref: MSOP10_19-68_120X120_1-1; Mfr_part_number: TMUX154EDGSR; Voltage: NA; Wattage: NA; Package: VSSOP10; Distributor_name: DIGIKEY; Distributor_part_number: 296-48347-1-ND; Library Ref: TMUX154EDGSR_VSSOP10; Height: 1.10MM; Weight: NA; Temperature: -40癈+85癈; Datasheet: Y:\MIS_DATABASE\DATASHEETS\ICS\ANALOG\TMUX154EXXX.PDF; Crtd /date: MANIRAJA/040918; Chkd/date: MANIRAJA/040918; MECHANICAL 3D STEP FILE: MSOP10_19-68_120X120_1-1; Library Path: Y:\MIS_DATABASE\Library\ALTIUM_TOOL\SCHEMATICS_PARTS\MS_ANALOG-APPLICATION_Library.schlib; Footprint Path: Y:\MIS_DATABASE\Library\ALTIUM_TOOL\PCB_FOOTPRINTS\Altium_Footprint_Lib.PcbLib
U31 = SN74LVC1G08DBVRE4_SOT23-5: IC SINGLE 2-INPUT POSITIVE AND GATE SOT23-5; Part_type: ICS\DIGITAL\GATES; Mfr_name: TEXAS INSTRUMENTS; Mistral Part No: 141009060026-R; Custom_Duty: 15%; Customs_HS_Code: 85423100; Project: KHAN_MAIN; PCB Footprint: SOT23-5; RoHS: Sb/ Br FREE; Chkd/date: SUHAS/221010; Crtd /date: USMAN/151008; Datasheet: Y:\MIS_DATABASE\DATASHEETS\ICS\DIGITAL\GATES\SN74LVC1G08.PDF; Temperature: -40癈+85癈; Height: 1.45MM; Library Ref: SN74LVC1G08DBVRE4_SOT23-5; Distributor_part_number: SN74LVC1G08DBVRE4-ND; Distributor_name: DIGIKEY; Package: SOT23-5; Mfr_part_number: SN74LVC1G08DBVRE4
U80 = DP83869HM_VQFN48: IC ETHERNET TRANSCEIVER 10/100/1000 WITH COPPER AND FIBRE INTERFACE VQFN48; Mistral Part No: 143019050002-R; Mfr_name: TEXAS INSTRUMENTS; Part_type: ICS\TELECOM\TRANSCEIVER; Project: J7ES_ENET_DP83869HM_EXP; Tolerance: NA; Customs_HS_Code: 85423100; Custom_Duty: 15%; PCB Footprint: QFN48_19-68_280X280_1_EP4-2; Footprint Ref: QFN48_19-68_280X280_1_EP4-2; Mfr_part_number: DP83869HMRGZT; Voltage: NA; Wattage: NA; Package: VQFN48; Distributor_name: DIGIKEY; Distributor_part_number: 296-53377-1-ND; Library Ref: DP83869HM_VQFN48; Height: 1.00MM; Weight: NA; Temperature: -40癈+125癈; Datasheet: Y:\MIS_DATABASE\DATASHEETS\ICS\TELECOM\DP83869HM.PDF; Crtd /date: ALVY/060519; Chkd/date: MANIRAJA/060519; MECHANICAL 3D STEP FILE: QFN48_19-68_280X280_1_EP4-2; Library Path: Y:\MIS_DATABASE\Library\ALTIUM_TOOL\SCHEMATICS_PARTS\MS_TELECOM_Library.schlib; Footprint Path: Y:\MIS_DATABASE\Library\ALTIUM_TOOL\PCB_FOOTPRINTS\Altium_Footprint_Lib.PcbLib